# Altium schematic sheet power_12V.SchDoc
size A4
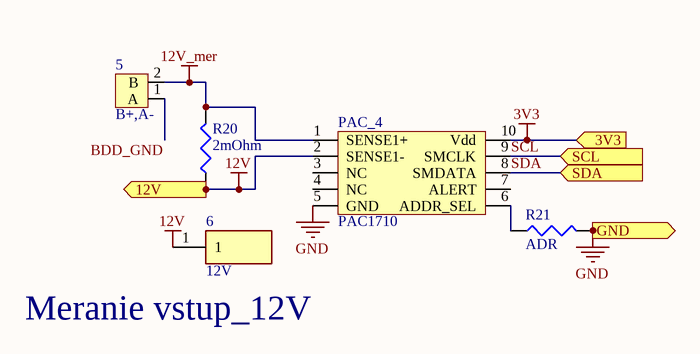
[diagram p0: power_12V.SchDoc]

## Parts
5  B+,A-  [CON_2CH_PLUG]
6  12V  [1508000150000030]
PAC_4  PAC1710  [PAC1710]
R20  2mOhm  [RESC3216X75N]
R21  ADR  [J1-0603]

## Ports
3V3 (in), 12V (out), GND (in), SCL (in), SDA (in)

## Nets
3V3: PAC_4.10(Vdd) ; port 3V3
12V: 6.1 PAC_4.2(SENSE1-) R20.1 ; port 12V
12V_mer: 5.2(B) PAC_4.1(SENSE1+) R20.2
GND: PAC_4.5(GND) R21.2 ; port GND
BDD_GND: 5.1(A)
SCL: PAC_4.9(SMCLK) ; port SCL
SDA: PAC_4.8(SMDATA) ; port SDA
NetPAC_4_6: PAC_4.6(ADDR_SEL) R21.1

Not connected (* = marked no-connect by the designer): PAC_4 3(NC) 4(NC) 7(ALERT)

## Notes on the sheet
- (near 6) Meranie vstup_12V

## Library data of the parts
5 = CON_2CH_PLUG: TBG-5.0-KW-2P
6 = 5015: Undefined or Miscellaneous; Manufacturer_Name: Keystone Electronics; Allied_Number: 70182998; Datasheet Link: http://www.keyelco.com/product-pdf.cfm?p=1353; Height: 1.52mm; Manufacturer_Part_Number: 5015; Mouser Part Number: 534-5015; Mouser Price/Stock: https://www.mouser.com/Search/Refine.aspx?Keyword=534-5015; Allied Price/Stock: https://www.alliedelec.com/keystone-electronics-5015/70182998/
R20 R21 = Res3: Resistor; Published: 8-Jun-2000; LatestRevisionDate: 29-May-2009; LatestRevisionNote: IPC-7351 Footprint Added.; PackageReference: J1-0603; Publisher: Altium Limited; PackageDescription: Chip Resistor
  R20: Value: 2mOhm
  R21: Value: ADR